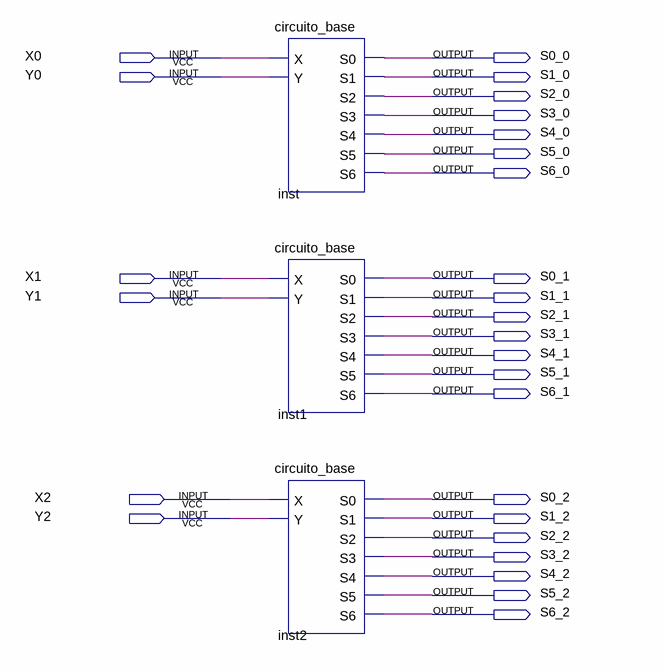
[diagram p0: schematic sheet]
// Quartus schematic Projeto_alf.bdf as structural Verilog: 3 symbols, 27 pins
module Projeto_alf (
  input  X0,
  input  Y0,
  input  X1,
  input  Y1,
  input  X2,
  input  Y2,
  output S0_0,
  output S1_0,
  output S2_0,
  output S3_0,
  output S4_0,
  output S5_0,
  output S6_0,
  output S0_1,
  output S1_1,
  output S2_1,
  output S3_1,
  output S4_1,
  output S5_1,
  output S6_1,
  output S0_2,
  output S1_2,
  output S2_2,
  output S3_2,
  output S4_2,
  output S5_2,
  output S6_2
);

  circuito_base inst (.X(X0), .Y(Y0), .S0(S0_0), .S1(S1_0), .S2(S2_0), .S3(S3_0), .S4(S4_0), .S5(S5_0), .S6(S6_0));
  circuito_base inst1 (.X(X1), .Y(Y1), .S0(S0_1), .S1(S1_1), .S2(S2_1), .S3(S3_1), .S4(S4_1), .S5(S5_1), .S6(S6_1));
  circuito_base inst2 (.X(X2), .Y(Y2), .S0(S0_2), .S1(S1_2), .S2(S2_2), .S3(S3_2), .S4(S4_2), .S5(S5_2), .S6(S6_2));
endmodule
